# EAGLE schematic Primary (EAGLE 5.12)

## Sheet 1 of 4
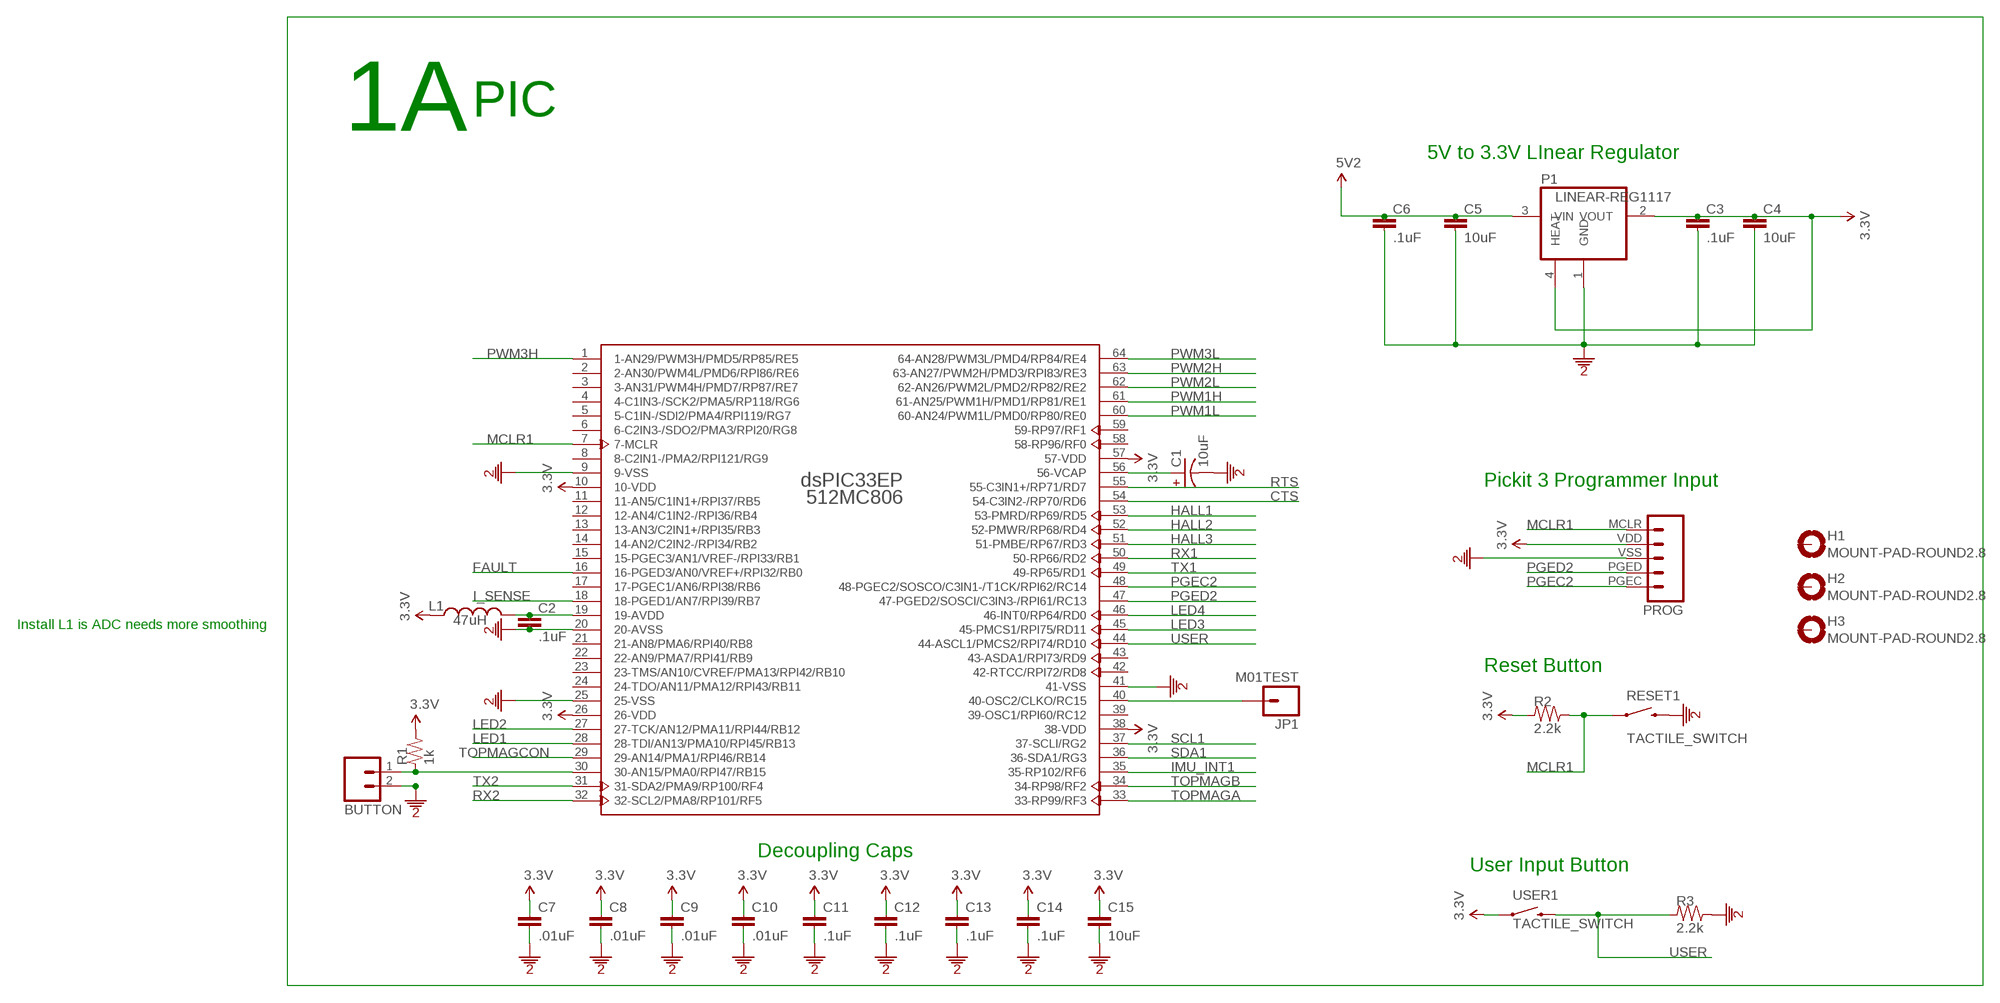
[diagram p0: schematic, sheet 1]

### Parts
BUTTON  M02JST-PH-SMD  [JST-2-PH-SMD]
C1  10uF  CAP-POL0603  [0603-POL]
C2  .1uF  CAP0603  [0603]
C3  .1uF  CAP0603  [0603]
C4  10uF  CAP1206  [1206]
C5  10uF  CAP1206  [1206]
C6  .1uF  CAP0603  [0603]
C7  .01uF  CAP0603  [0603]
C8  .01uF  CAP0603  [0603]
C9  .01uF  CAP0603  [0603]
C10  .01uF  CAP0603  [0603]
C11  .1uF  CAP0603  [0603]
C12  .1uF  CAP0603  [0603]
C13  .1uF  CAP0603  [0603]
C14  .1uF  CAP0603  [0603]
C15  10uF  CAP1206  [1206]
H1  MOUNT-PAD-ROUND2.8  [2,8-PAD]
H2  MOUNT-PAD-ROUND2.8  [2,8-PAD]
H3  MOUNT-PAD-ROUND2.8  [2,8-PAD]
JP1  M01TEST  [1X01_TEST]
L1  47uH  INDUCTOR0603  [0603]
P1  LINEAR-REG1117  [SOT223]
PROG  M05PICKIT3  [1X05-PICKIT3]
R1  1k  R0603  [0603]
R2  2.2k  R0603  [0603]
R3  2.2k  R0603  [0603]
RESET1  TACTILE_SWITCH  [TACTILE_SWITCH]
U$1  DSPIC33EP512MC806  [TQFP64_10X10]
USER1  TACTILE_SWITCH  [TACTILE_SWITCH]

### Nets
3.3V: C3.1 C4.1 C7.1 C8.1 C9.1 C10.1 C11.1 C12.1 C13.1 C14.1 C15.1 L1.1 P1.2(VOUT) P1.4(HEAT) PROG.VDD R1.2 R2.1 U$1.10(10-VDD) U$1.26(26-VDD) U$1.38(38-VDD) U$1.57(57-VDD) USER1.1 ; also sheet 2
5V2: C5.1 C6.1 P1.3(VIN) ; also sheet 2,3,4
CTS: U$1.54(54-C3IN2-/RP70/RD6) ; also sheet 2
FAULT: U$1.16(16-PGED3/AN0/VREF+/RPI32/RB0)
GND2: BUTTON.2 C1.- C2.2 C3.2 C4.2 C5.2 C6.2 C7.2 C8.2 C9.2 C10.2 C11.2 C12.2 C13.2 C14.2 C15.2 P1.1(GND) PROG.VSS R3.2 RESET1.2 U$1.9(9-VSS) U$1.20(20-AVSS) U$1.25(25-VSS) U$1.41(41-VSS) ; supply symbol labelled GND ; also sheet 2,3,4
HALL1: U$1.53(53-PMRD/RP69/RD5) ; also sheet 2
HALL2: U$1.52(52-PMWR/RP68/RD4) ; also sheet 2
HALL3: U$1.51(51-PMBE/RP67/RD3) ; also sheet 2
I_SENSE: U$1.18(18-PGED1/AN7/RPI39/RB7) ; also sheet 2
IMU_INT1: U$1.35(35-RP102/RF6) ; also sheet 2
LED1: U$1.28(28-TDI/AN13/PMA10/RPI45/RB13) ; also sheet 2
LED2: U$1.27(27-TCK/AN12/PMA11/RPI44/RB12) ; also sheet 2
LED3: U$1.45(45-PMCS1/RPI75/RD11) ; also sheet 2
LED4: U$1.46(46-INT0/RP64/RD0) ; also sheet 2
MCLR1: PROG.MCLR R2.2 RESET1.1 U$1.7(7-MCLR)
N$4: C1.+ U$1.56(56-VCAP)
N$6: C2.1 L1.2 U$1.19(19-AVDD)
N$8: BUTTON.1 R1.1 U$1.30(30-AN15/PMA0/RPI47/RB15)
N$9: JP1.1 U$1.40(40-OSC2/CLKO/RC15)
PGEC2: PROG.PGEC U$1.48(48-PGEC2/SOSCO/C3IN1-/T1CK/RPI62/RC14)
PGED2: PROG.PGED U$1.47(47-PGED2/SOSCI/C3IN3-/RPI61/RC13)
PWM1H: U$1.61(61-AN25/PWM1H/PMD1/RP81/RE1) ; also sheet 4
PWM1L: U$1.60(60-AN24/PWM1L/PMD0/RP80/RE0) ; also sheet 4
PWM2H: U$1.63(63-AN27/PWM2H/PMD3/RPI83/RE3) ; also sheet 4
PWM2L: U$1.62(62-AN26/PWM2L/PMD2/RP82/RE2) ; also sheet 4
PWM3H: U$1.1(1-AN29/PWM3H/PMD5/RP85/RE5) ; also sheet 4
PWM3L: U$1.64(64-AN28/PWM3L/PMD4/RP84/RE4) ; also sheet 4
RTS: U$1.55(55-C3IN1+/RP71/RD7) ; also sheet 2
RX1: U$1.50(50-RP66/RD2) ; also sheet 2
RX2: U$1.32(32-SCL2/PMA8/RP101/RF5) ; also sheet 2
SCL1: U$1.37(37-SCLI/RG2) ; also sheet 2
SDA1: U$1.36(36-SDA1/RG3) ; also sheet 2
TOPMAGA: U$1.33(33-RP99/RF3) ; also sheet 2
TOPMAGB: U$1.34(34-RP98/RF2) ; also sheet 2
TOPMAGCON: U$1.29(29-AN14/PMA1/RPI46/RB14) ; also sheet 4
TX1: U$1.49(49-RP65/RD1) ; also sheet 2
TX2: U$1.31(31-SDA2/PMA9/RP100/RF4) ; also sheet 2
USER: R3.1 U$1.44(44-ASCL1/PMCS2/RPI74/RD10) USER1.2
Unconnected: H1.B2,8(MOUNT) H2.B2,8(MOUNT) H3.B2,8(MOUNT) U$1.2(2-AN30/PWM4L/PMD6/RPI86/RE6) U$1.3(3-AN31/PWM4H/PMD7/RP87/RE7) U$1.4(4-C1IN3-/SCK2/PMA5/RP118/RG6) U$1.5(5-C1IN-/SDI2/PMA4/RPI119/RG7) U$1.6(6-C2IN3-/SDO2/PMA3/RPI20/RG8) U$1.8(8-C2IN1-/PMA2/RPI121/RG9) U$1.11(11-AN5/C1IN1+/RPI37/RB5) U$1.12(12-AN4/C1IN2-/RPI36/RB4) U$1.13(13-AN3/C2IN1+/RPI35/RB3) U$1.14(14-AN2/C2IN2-/RPI34/RB2) U$1.15(15-PGEC3/AN1/VREF-/RPI33/RB1) U$1.17(17-PGEC1/AN6/RPI38/RB6) U$1.21(21-AN8/PMA6/RPI40/RB8) U$1.22(22-AN9/PMA7/RPI41/RB9) U$1.23(23-TMS/AN10/CVREF/PMA13/RPI42/RB10) U$1.24(24-TDO/AN11/PMA12/RPI43/RB11) U$1.39(39-OSC1/RPI60/RC12) U$1.42(42-RTCC/RPI72/RD8) U$1.43(43-ASDA1/RPI73/RD9) U$1.58(58-RP96/RF0) U$1.59(59-RP97/RF1)

### Notes on the sheet
- 1A | PIC
- 5V to 3.3V LInear Regulator
- Pickit 3 Programmer Input
- Install L1 is ADC needs more smoothing
- Reset Button
- Decoupling Caps
- User Input Button

## Sheet 2 of 4
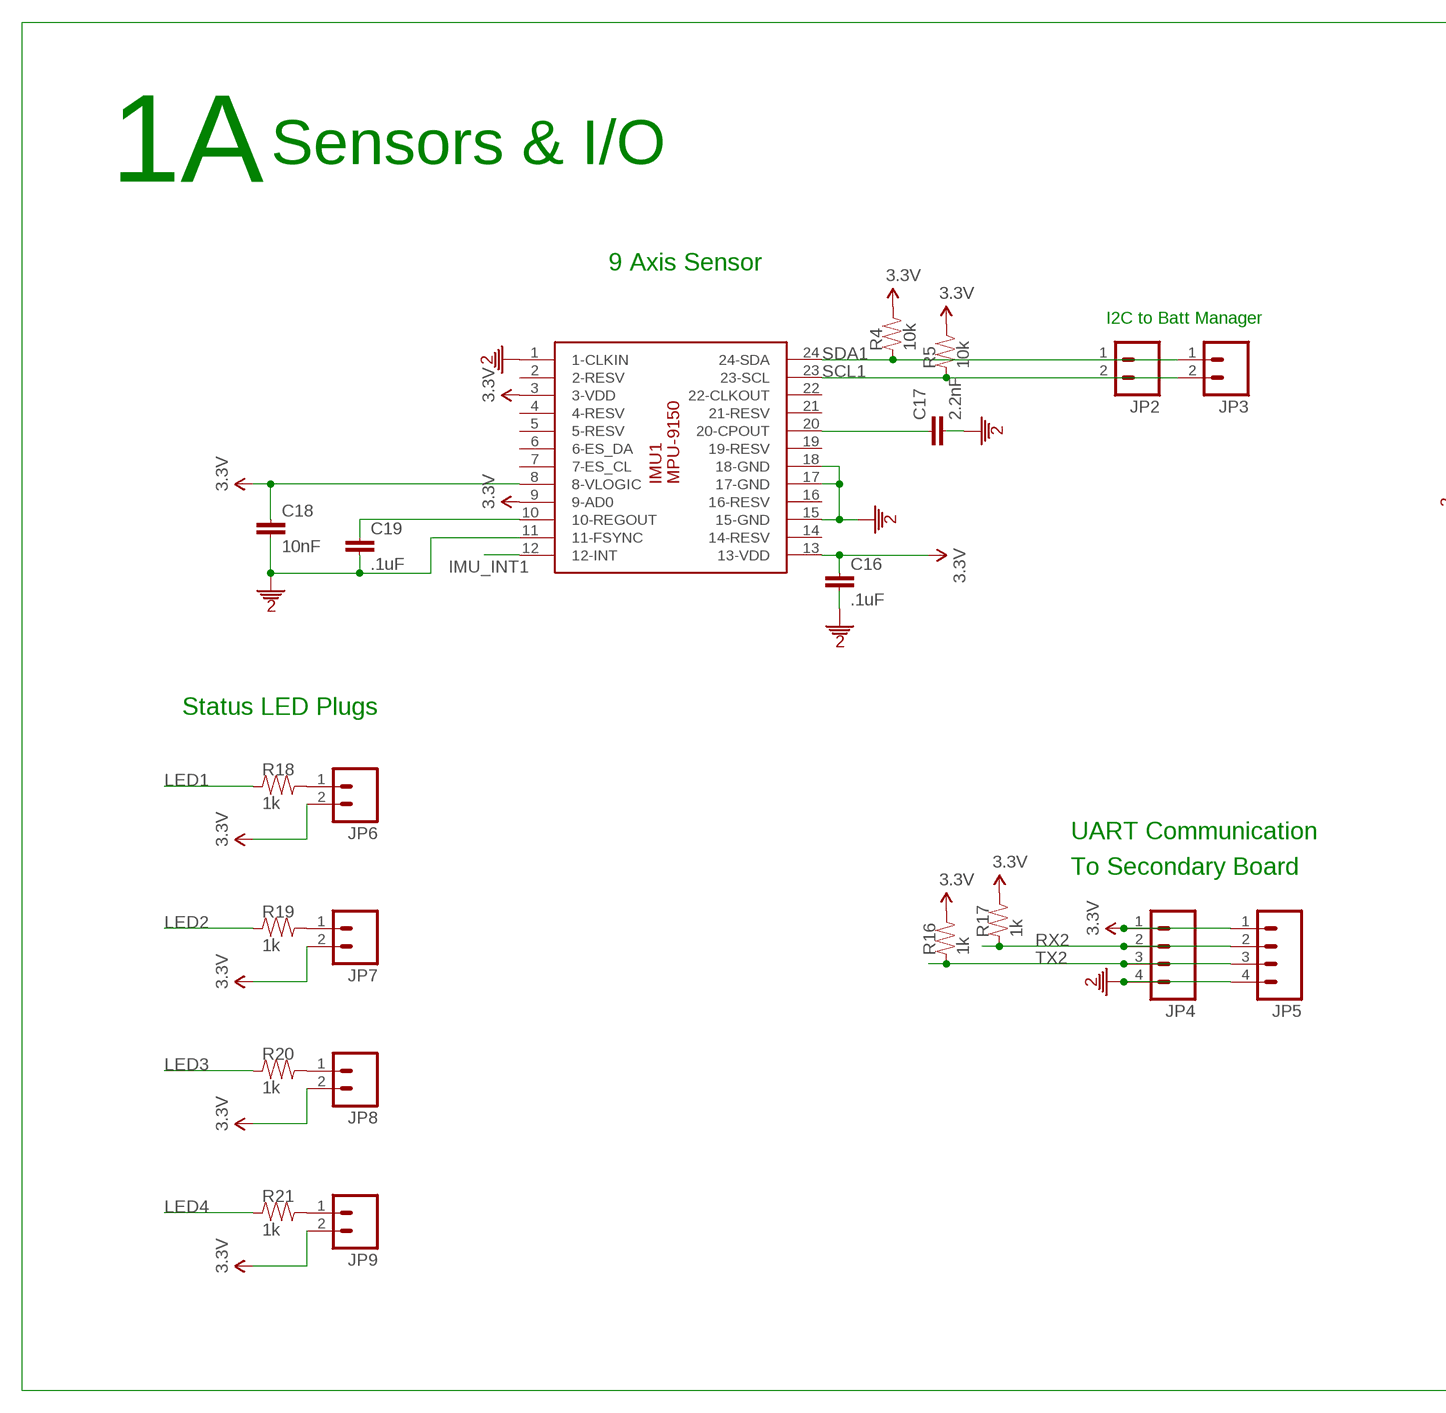
[diagram p1: schematic, sheet 2, part 1 of 2]
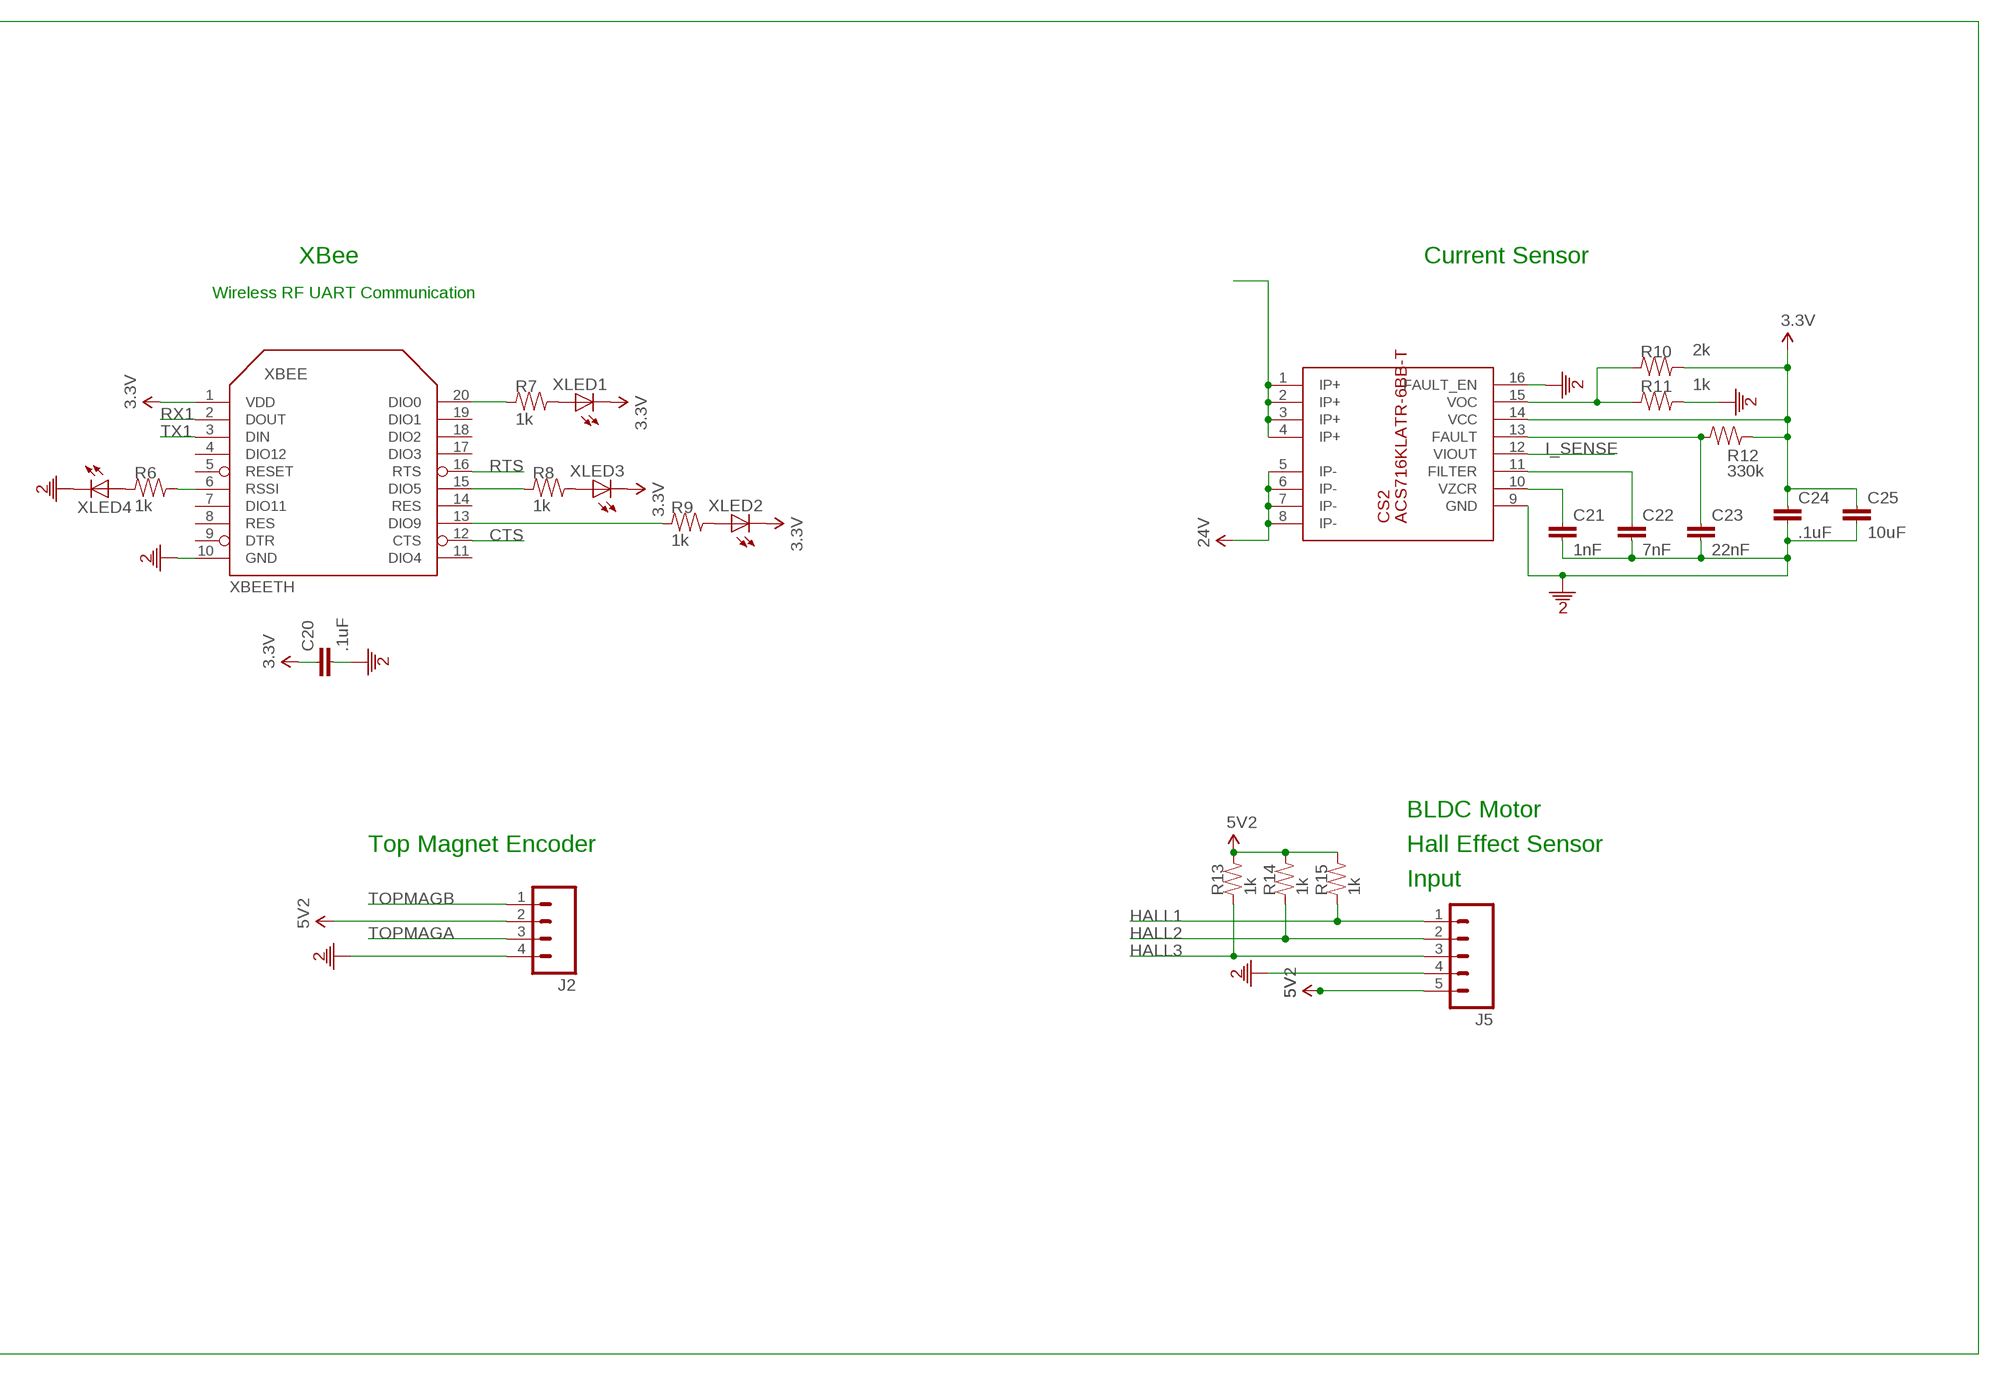
[diagram p2: schematic, sheet 2, part 2 of 2]

### Parts
C16  .1uF  CAP0603  [0603]
C17  2.2nF  CAP0603  [0603]
C18  10nF  CAP0603  [0603]
C19  .1uF  CAP0603  [0603]
C20  .1uF  CAP1206  [1206]
C21  1nF  CAP0603  [0603]
C22  7nF  CAP0603  [0603]
C23  22nF  CAP0603  [0603]
C24  .1uF  CAP0603  [0603]
C25  10uF  CAP0603  [0603]
CS2  ACS716KLATR-6BB-T  ACS716  [SOIC16-W]
IMU1  MPU-9150  [LGA24_4X4]
J2  M04PH-SMD  [JST-4-PH-SMD]
J5  M05JST-SH  [JST-5-SH]
JP2  M02JST-PH-SMD  [JST-2-PH-SMD]
JP3  M02JST-PH-V  [JST-2-PH-V]
JP4  M04PH-TH  [JST-4-PH-TH]
JP5  M04JST-PH-V  [JST-4-PH-V]
JP6  M02JST-PH-V  [JST-2-PH-V]
JP7  M02JST-PH-V  [JST-2-PH-V]
JP8  M02JST-PH-V  [JST-2-PH-V]
JP9  M02JST-PH-V  [JST-2-PH-V]
R4  10k  R0402  [0402]
R5  10k  R0402  [0402]
R6  1k  R0603  [0603]
R7  1k  R0603  [0603]
R8  1k  R0603  [0603]
R9  1k  R0603  [0603]
R10  2k  R0603  [0603]
R11  1k  R0603  [0603]
R12  330k  R0603  [0603]
R13  1k  R0402  [0402]
R14  1k  R0402  [0402]
R15  1k  R0402  [0402]
R16  1k  R0402  [0402]
R17  1k  R0402  [0402]
R18  1k  R0603  [0603]
R19  1k  R0603  [0603]
R20  1k  R0603  [0603]
R21  1k  R0603  [0603]
XBEE  XBEETH  [XBEE-SILK]
XLED1  LED0603  [0603-DIODE]
XLED2  LED0603  [0603-DIODE]
XLED3  LED0603  [0603-DIODE]
XLED4  LED0603  [0603-DIODE]

### Nets
3.3V: C16.1 C18.1 C20.1 C24.1 C25.1 CS2.14(VCC) IMU1.3(3-VDD) IMU1.8(8-VLOGIC) IMU1.9(9-AD0) IMU1.13(13-VDD) JP4.1 JP5.1 JP6.2 JP7.2 JP8.2 JP9.2 R4.2 R5.2 R10.2 R12.2 R16.2 R17.2 XBEE.1(VDD) XLED1.CAT(C) XLED2.CAT(C) XLED3.CAT(C) ; also sheet 1
5V2: J2.2 J5.5 R13.2 R14.2 R15.2 ; supply symbol labelled 5V ; also sheet 1,3,4
24V: CS2.5(IP-) CS2.6(IP-) CS2.7(IP-) CS2.8(IP-) ; also sheet 3,4
CTS: XBEE.12(CTS) ; also sheet 1
GND2: C16.2 C17.2 C18.2 C19.2 C20.2 C21.2 C22.2 C23.2 C24.2 C25.2 CS2.9(GND) CS2.16(FAULT_EN) IMU1.1(1-CLKIN) IMU1.11(11-FSYNC) IMU1.15(15-GND) IMU1.17(17-GND) IMU1.18(18-GND) J2.4 J5.4 JP4.4 JP5.4 R11.2 XBEE.10(GND) XLED4.CAT(C) ; also sheet 1,3,4
HALL1: J5.1 R15.1 ; also sheet 1
HALL2: J5.2 R14.1 ; also sheet 1
HALL3: J5.3 R13.1 ; also sheet 1
I_SENSE: CS2.12(VIOUT) ; also sheet 1
IMU_INT1: IMU1.12(12-INT) ; also sheet 1
LED1: R18.1 ; also sheet 1
LED2: R19.1 ; also sheet 1
LED3: R20.1 ; also sheet 1
LED4: R21.1 ; also sheet 1
MOTOR+: CS2.1(IP+) CS2.2(IP+) CS2.3(IP+) CS2.4(IP+) ; also sheet 4
N$16: C17.1 IMU1.20(20-CPOUT)
N$18: C19.1 IMU1.10(10-REGOUT)
N$19: R6.2 XBEE.6(RSSI)
N$20: R6.1 XLED4.AN(A)
N$21: R7.1 XBEE.20(DIO0)
N$22: R7.2 XLED1.AN(A)
N$23: R8.2 XLED3.AN(A)
N$24: R9.2 XLED2.AN(A)
N$25: R8.1 XBEE.15(DIO5)
N$26: R9.1 XBEE.13(DIO9)
N$28: CS2.15(VOC) R10.1 R11.1
N$29: C21.1 CS2.10(VZCR)
N$30: C23.1 CS2.13(FAULT) R12.1
N$31: C22.1 CS2.11(FILTER)
N$32: JP6.1 R18.2
N$34: JP7.1 R19.2
N$35: JP8.1 R20.2
N$36: JP9.1 R21.2
RTS: XBEE.16(RTS) ; also sheet 1
RX1: XBEE.2(DOUT) ; also sheet 1
RX2: JP4.2 JP5.2 R17.1 ; also sheet 1
SCL1: IMU1.23(23-SCL) JP2.2 JP3.2 R5.1 ; also sheet 1
SDA1: IMU1.24(24-SDA) JP2.1 JP3.1 R4.1 ; also sheet 1
TOPMAGA: J2.3 ; also sheet 1
TOPMAGB: J2.1 ; also sheet 1
TX1: XBEE.3(DIN) ; also sheet 1
TX2: JP4.3 JP5.3 R16.1 ; also sheet 1
Unconnected: IMU1.2(2-RESV) IMU1.4(4-RESV) IMU1.5(5-RESV) IMU1.6(6-ES_DA) IMU1.7(7-ES_CL) IMU1.14(14-RESV) IMU1.16(16-RESV) IMU1.19(19-RESV) IMU1.21(21-RESV) IMU1.22(22-CLKOUT) XBEE.4(DIO12) XBEE.5(RESET) XBEE.7(DIO11) XBEE.8(RES) XBEE.9(DTR) XBEE.11(DIO4) XBEE.14(RES) XBEE.17(DIO3) XBEE.18(DIO2) XBEE.19(DIO1)

### Notes on the sheet
- 1A | Sensors & I/O
- 9 Axis Sensor | XBee | Current Sensor
- Wireless RF UART Communication
- I2C to Batt Manager
- Status LED Plugs
- UART Communication | BLDC Motor
- To Secondary Board | Top Magnet Encoder | Hall Effect Sensor
- Input

## Sheet 3 of 4
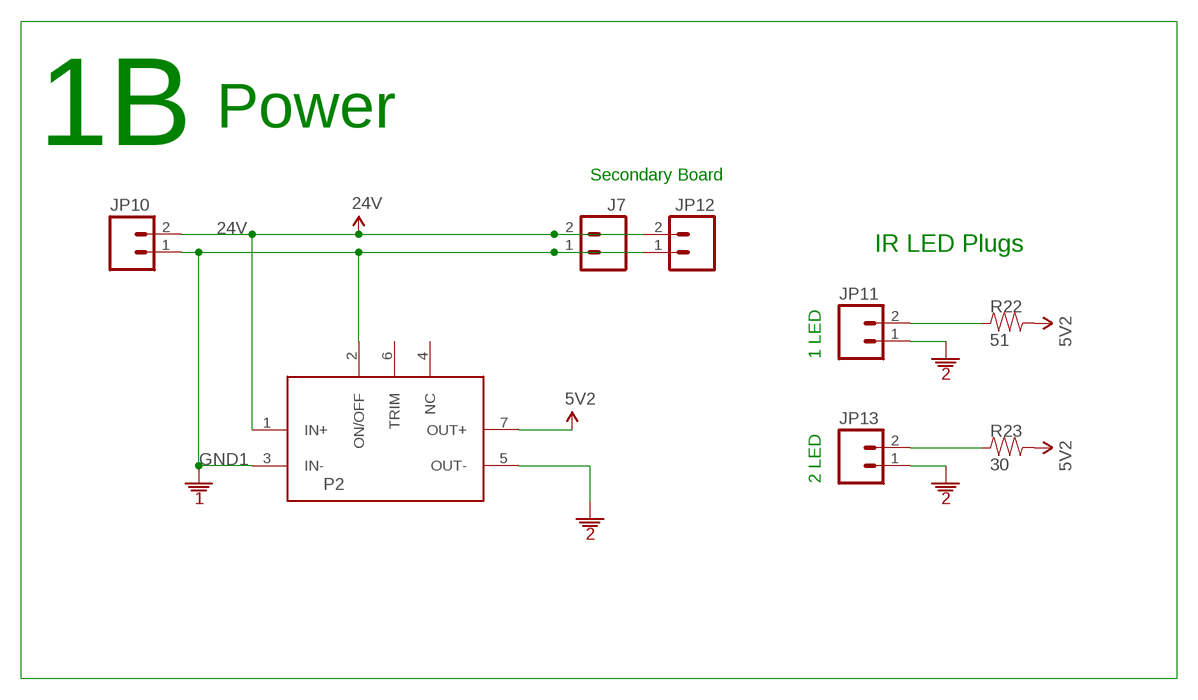
[diagram p3: schematic, sheet 3]

### Parts
J7  M02JST-PH-TH  [JST-2-PH-TH]
JP10  M02MINI-MATENLOK-2  [TE-MINIMATENLOK-2]
JP11  M02JST-PH-SMD  [JST-2-PH-SMD]
JP12  M02JST-PH-V  [JST-2-PH-V]
JP13  M02JST-PH-SMD  [JST-2-PH-SMD]
P2  DC-DC-CONVERTER1.2A  [CC6-2405SF-E]
R22  51  R0603  [0603]
R23  30  R0603  [0603]

### Nets
5V2: P2.7(OUT+) R22.2 R23.2 ; also sheet 1,2,4
24V: J7.2 JP10.2 JP12.2 P2.1(IN+) ; also sheet 2,4
GND1: J7.1 JP10.1 JP12.1 P2.2(ON/OFF) P2.3(IN-) ; also sheet 4
GND2: JP11.1 JP13.1 P2.5(OUT-) ; also sheet 1,2,4
N$43: JP11.2 R22.1
N$44: JP13.2 R23.1
Unconnected: P2.4(NC) P2.6(TRIM)

### Notes on the sheet
- 1B | Power
- Secondary Board
- IR LED Plugs
- 1 LED
- 2 LED

## Sheet 4 of 4
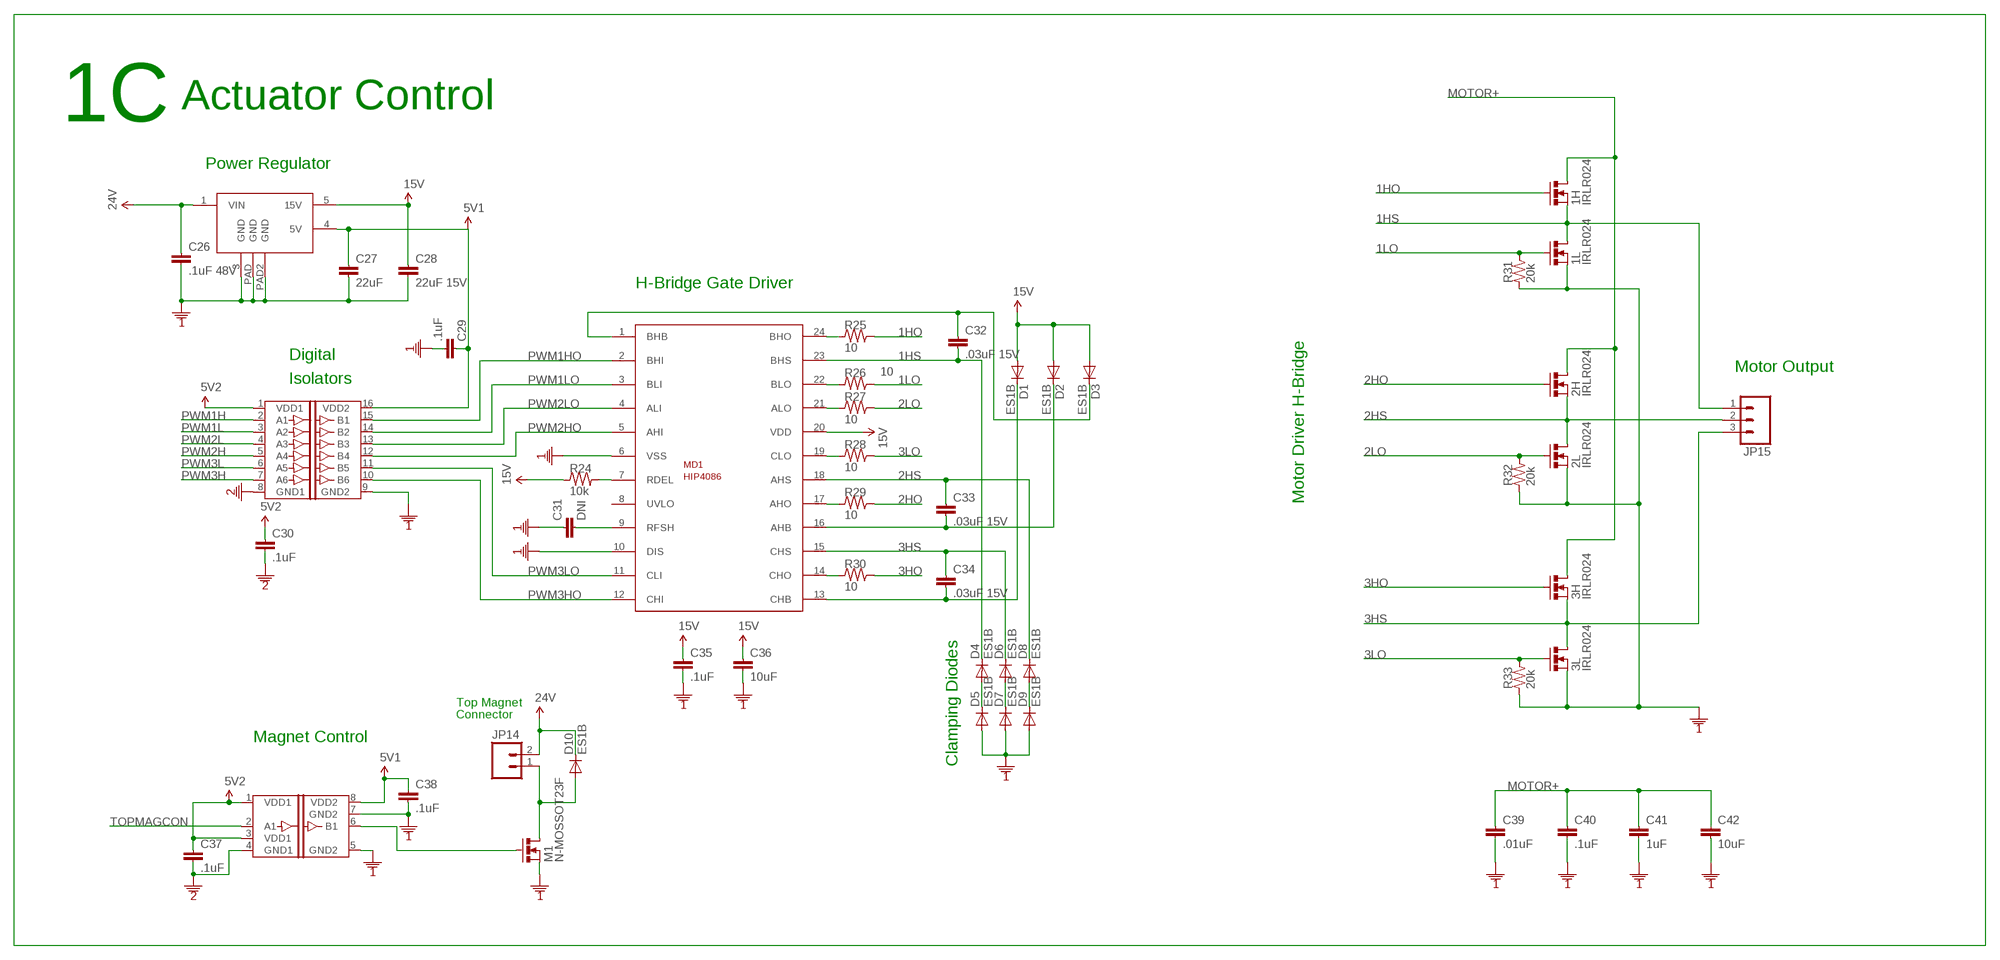
[diagram p4: schematic, sheet 4]

### Parts
1H  IRLR024  N-MOSDPAK  [DPAK]
1L  IRLR024  N-MOSDPAK  [DPAK]
2H  IRLR024  N-MOSDPAK  [DPAK]
2L  IRLR024  N-MOSDPAK  [DPAK]
3H  IRLR024  N-MOSDPAK  [DPAK]
3L  IRLR024  N-MOSDPAK  [DPAK]
C26  .1uF 48V  CAP0603  [0603]
C27  22uF  CAP0603  [0603]
C28  22uF 15V  CAP0603  [0603]
C29  .1uF  CAP0603  [0603]
C30  .1uF  CAP0603  [0603]
C31  DNI  CAP0603  [0603]
C32  .03uF 15V  CAP0603  [0603]
C33  .03uF 15V  CAP0603  [0603]
C34  .03uF 15V  CAP0603  [0603]
C35  .1uF  CAP0603  [0603]
C36  10uF  CAP0603  [0603]
C37  .1uF  CAP0603  [0603]
C38  .1uF  CAP0603  [0603]
C39  .01uF  CAP0603  [0603]
C40  .1uF  CAP0603  [0603]
C41  1uF  CAP1206  [1206]
C42  10uF  CAP1206  [1206]
D1  ES1B  DIODESMA  [SMA-DIODE]
D2  ES1B  DIODESMA  [SMA-DIODE]
D3  ES1B  DIODESMA  [SMA-DIODE]
D4  ES1B  DIODESMA  [SMA-DIODE]
D5  ES1B  DIODESMA  [SMA-DIODE]
D6  ES1B  DIODESMA  [SMA-DIODE]
D7  ES1B  DIODESMA  [SMA-DIODE]
D8  ES1B  DIODESMA  [SMA-DIODE]
D9  ES1B  DIODESMA  [SMA-DIODE]
D10  ES1B  DIODESMA  [SMA-DIODE]
JP14  M02JST-PH-SMD  [JST-2-PH-SMD]
JP15  M03MINIFITJR  [MOLEX-3-MINIFITJR-RA]
M1  N-MOSSOT23F  [SOT23F]
MD1  HIP4086  [SOIC24-W]
R24  10k  R0603  [0603]
R25  10  R0603  [0603]
R26  10  R0603  [0603]
R27  10  R0603  [0603]
R28  10  R0603  [0603]
R29  10  R0603  [0603]
R30  10  R0603  [0603]
R31  20k  R0603  [0603]
R32  20k  R0603  [0603]
R33  20k  R0603  [0603]
U$46  DIGITAL-ISOLATOR-6CHSI8660EC-B-IS1  [SOIC16-N]
U$47  IFX21004TNV51  [TO220-5]
U$61  DIGITAL-ISOLATOR-1CHSOIC8-N  [SOIC8-N]

### Nets
1HO: 1H.G R25.2
1HS: 1H.S 1L.D C32.2 D4.C JP15.1 MD1.23(BHS)
1LO: 1L.G R26.2 R31.2
2HO: 2H.G R29.2
2HS: 2H.S 2L.D C33.1 D8.C JP15.2 MD1.18(AHS)
2LO: 2L.G R27.2 R32.2
3HO: 3H.G R30.2
3HS: 3H.S 3L.D C34.1 D6.C JP15.3 MD1.15(CHS)
3LO: 3L.G R28.2 R33.2
5V1: C27.1 C29.1 C38.1 U$46.16(VDD2) U$47.4(5V) U$61.8(VDD2)
5V2: C30.1 C37.1 U$46.1(VDD1) U$61.1(VDD1) U$61.3(VDD1) ; also sheet 1,2,3
15V: C28.1 C35.1 C36.1 D1.A D2.A D3.A MD1.20(VDD) R24.1 U$47.5(15V)
24V: C26.1 D10.C JP14.2 U$47.1(VIN) ; also sheet 2,3
GND1: 1L.S 2L.S 3L.S C26.2 C27.2 C28.2 C29.2 C31.1 C35.2 C36.2 C38.2 C39.2 C40.2 C41.2 C42.2 D5.A D7.A D9.A M1.S MD1.6(VSS) MD1.10(DIS) R31.1 R32.1 R33.1 U$46.9(GND2) U$47.3(GND) U$47.PAD2(GND) U$47.PAD(GND) U$61.5(GND2) U$61.7(GND2) ; also sheet 3
GND2: C30.2 C37.2 U$46.8(GND1) U$61.4(GND1) ; also sheet 1,2,3
MOTOR+: 1H.D 2H.D 3H.D C39.1 C40.1 C41.1 C42.1 ; also sheet 2
N$38: MD1.24(BHO) R25.1
N$39: MD1.22(BLO) R26.1
N$40: MD1.21(ALO) R27.1
N$41: MD1.19(CLO) R28.1
N$42: MD1.17(AHO) R29.1
N$45: MD1.14(CHO) R30.1
N$47: C31.2 MD1.9(RFSH)
N$48: MD1.7(RDEL) R24.2
N$49: D4.A D5.C
N$50: D6.A D7.C
N$51: D8.A D9.C
N$52: C32.1 D3.C MD1.1(BHB)
N$55: C34.2 D1.C MD1.13(CHB)
N$56: C33.2 D2.C MD1.16(AHB)
N$57: M1.G U$61.6(B1)
N$58: D10.A JP14.1 M1.D
PWM1H: U$46.2(A1) ; also sheet 1
PWM1HO: MD1.2(BHI) U$46.15(B1)
PWM1L: U$46.3(A2) ; also sheet 1
PWM1LO: MD1.3(BLI) U$46.14(B2)
PWM2H: U$46.5(A4) ; also sheet 1
PWM2HO: MD1.5(AHI) U$46.12(B4)
PWM2L: U$46.4(A3) ; also sheet 1
PWM2LO: MD1.4(ALI) U$46.13(B3)
PWM3H: U$46.7(A6) ; also sheet 1
PWM3HO: MD1.12(CHI) U$46.10(B6)
PWM3L: U$46.6(A5) ; also sheet 1
PWM3LO: MD1.11(CLI) U$46.11(B5)
TOPMAGCON: U$61.2(A1) ; also sheet 1
Unconnected: MD1.8(UVLO)

### Notes on the sheet
- 1C | Actuator Control
- Power Regulator
- H-Bridge Gate Driver
- Digital
- Motor Output
- Isolators
- Motor Driver H-Bridge
- Top Magnet
- Connector
- Magnet Control
- Clamping Diodes

## Library data of the parts
1H 1L 2H 2L 3H 3L M1 = GibbotV5:N-MOS
BUTTON J7 JP2 JP3 JP6-JP14 = GibbotV5:M02: Header 2 Standard 2-pin 0.1" header. Use with straight break away headers (SKU : PRT-00116), right angle break away headers (PRT-00553), swiss pins (PRT-00743), machine pins (PRT-00117), and female headers (PRT-00115). Molex polarized connector foot print use with SKU : PRT-08233 with associated crimp pins and housings.
C1 = GibbotV5:CAP-POL: CAPACITOR, American symbol
C2-C42 = GibbotV5:CAP: Capacitor Standard 0603 ceramic capacitor, and 0.1" leaded capacitor.
CS2 = GibbotV5:ACS716
D1-D10 = GibbotV5:DIODE: Diode These are standard reverse protection diodes and small signal diodes. SMA package can handle up to about 1A. SOD-323 can handle about 200mA. What the SOD-323 package when ordering, there are some mfgs out there that are 5-pin packages.
H1-H3 = GibbotV5:MOUNT-PAD-ROUND: MOUNTING PAD, round
IMU1 = GibbotV5:MPU-9150
J2 JP4 JP5 = GibbotV5:M04: Header 4 Standard 4-pin 0.1" header. Use with straight break away headers (SKU : PRT-00116), right angle break away headers (PRT-00553), swiss pins (PRT-00743), machine pins (PRT-00117), and female headers (PRT-00115). Molex polarized connector foot print use with SKU : PRT-08231 with associated crimp pins and housings. 1MM SMD Version SKU: PRT-10208
J5 PROG = GibbotV5:M05: Header 5 Standard 5-pin 0.1" header. Use with straight break away headers (SKU : PRT-00116), right angle break away headers (PRT-00553), swiss pins (PRT-00743), machine pins (PRT-00117), and female headers (PRT-00115). Molex polarized connector foot print use with SKU : PRT-08230 with associated crimp pins and housings.
JP1 = GibbotV5:M01: Header 1 Standard 1-pin 0.1" header. Use with straight break away headers (SKU : PRT-00116), right angle break away headers (PRT-00553), swiss pins (PRT-00743), machine pins (PRT-00117), and female headers (PRT-00115).
JP15 = GibbotV5:M03: Header 3 Standard 3-pin 0.1" header. Use with straight break away headers (SKU : PRT-00116), right angle break away headers (PRT-00553), swiss pins (PRT-00743), machine pins (PRT-00117), and female headers (PRT-00115). Molex polarized connector foot print use with SKU : PRT-08232 with associated crimp pins and housings.
L1 = GibbotV5:INDUCTOR: Inductors Basic Inductor/Choke - 0603 and 1206. Footprints are not proven and vary greatly between part numbers.
MD1 = GibbotV5:HIP4086
P1 = GibbotV5:LINEAR-REG
P2 = GibbotV5:DC-DC-CONVERTER
R1-R33 = GibbotV5:R: RESISTOR, American symbol
RESET1 USER1 = GibbotV5:TACTILE_SWITCH
U$1 = GibbotV5:DSPIC33EP512MC806
U$46 = GibbotV5:DIGITAL-ISOLATOR-6CH
U$47 = GibbotV5:IFX21004TNV51
U$61 = GibbotV5:DIGITAL-ISOLATOR-1CH
XBEE = GibbotV5:XBEE
XLED1-XLED4 = GibbotV5:LED: LEDs Standard schematic elements and footprints for 5mm, 3mm, 1206, and 0603 sized LEDs. 5mm - Spark Fun Electronics SKU : COM-00529 (and others)